# Altium schematic sheet Micro.SchDoc
size A; SheetNumber: 1; SheetTotal: 5; SPICEModelCacheCJDBQKXO: <root> / <DocumentId>CJDBQKXO</DocumentId> / <CacheFrame Number="0"> / <Model Name="cap" Kind="MDL"> / <Text>*Default semiconductor capacitor / .MODEL CAP C()</Text> / </Model> / </CacheFrame> / </root>
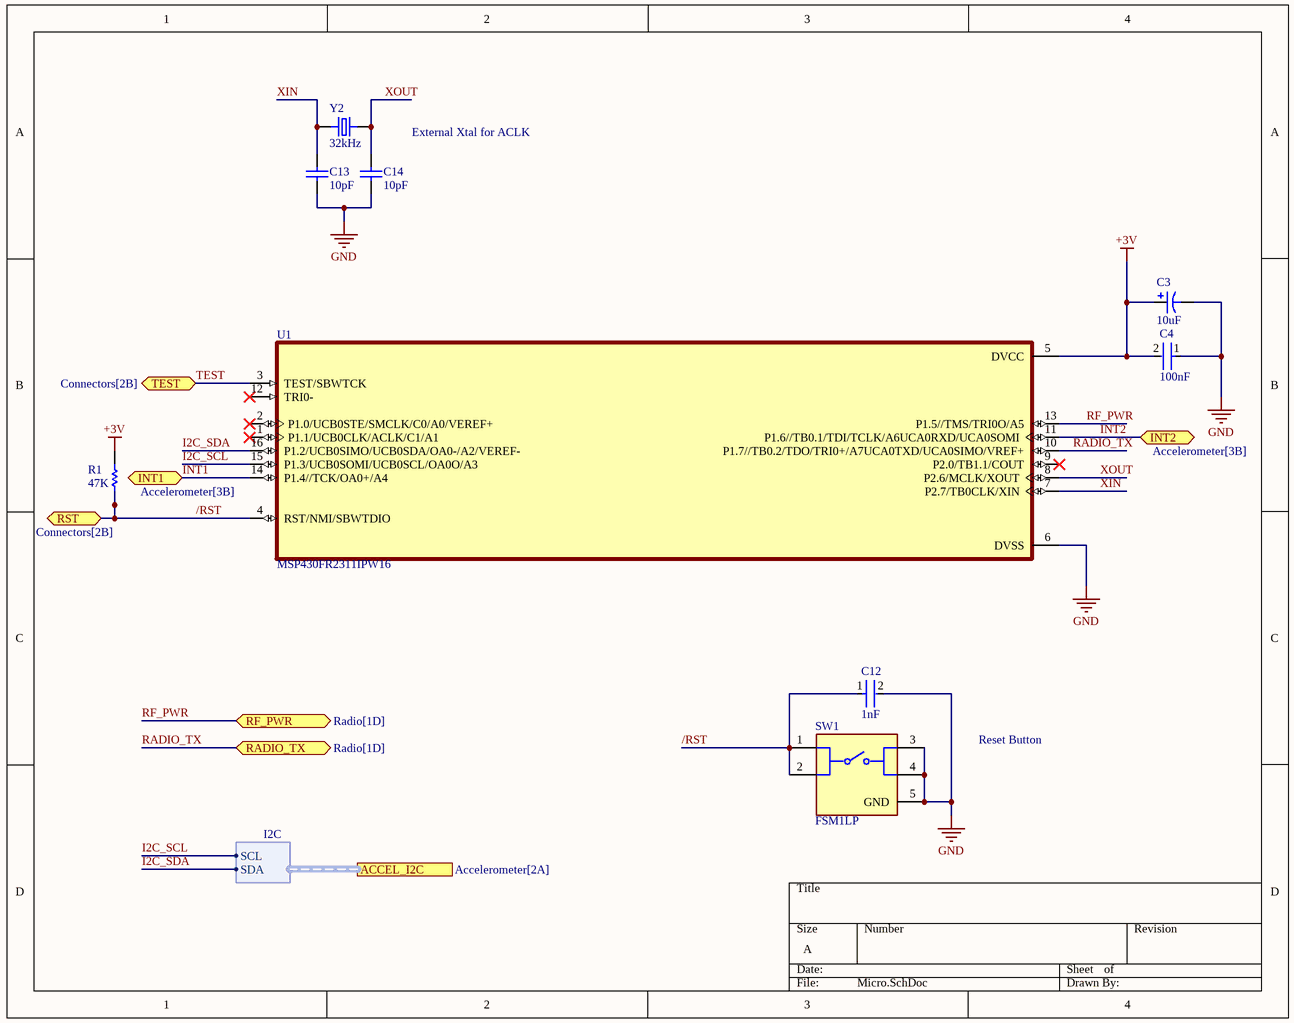
[diagram p0: Micro.SchDoc]

## Parts
C3  10uF  [C0805]
C4  100nF  [FP-C0402-BB-MFG]
C12  1nF  [FP-0603-L_1_6_0_15-W_0_81-IPC_A]
C13  10pF  [CAPC1608X90X40ML10T20]
C14  10pF  [CAPC1608X90X40ML10T20]
R1  47K  [J1-0603]
SW1  FSM1LP  [FP-FSM1LP-MFG]
U1  MSP430FR2311IPW16  [SOP65P640X120-16N]
Y2  32kHz  [XTAL_ECS-.327-6-34RR-TR]

## Ports
ACCEL_I2C (harness I2C, see Accelerometer[2A]), INT1 (bidir, see Accelerometer[3B]), INT2 (bidir, see Accelerometer[3B]), RADIO_TX (bidir, see Radio[1D]), RF_PWR (bidir, see Radio[1D]), RST (bidir, see Connectors[2B]), TEST (bidir, see Connectors[2B])

## Harnesses
I2C: SDA, SCL

## Nets
+3V: C3.1 C4.2 R1.2 U1.5(DVCC)
GND: C3.2 C4.1 C12.2 C13.1 C14.1 SW1.3 SW1.4 SW1.5(GND) U1.6(DVSS)
/RST: C12.1 R1.1 SW1.1 SW1.2 U1.4(RST/NMI/SBWTDIO) ; port RST
I2C_SCL: U1.15(P1.3/UCB0SOMI/UCB0SCL/OA0O/A3) ; port ACCEL_I2C.SCL
I2C_SDA: U1.16(P1.2/UCB0SIMO/UCB0SDA/OA0-/A2/VEREF-)
INT1: U1.14(P1.4//TCK/OA0+/A4) ; port INT1
INT2: U1.11(P1.6//TB0.1/TDI/TCLK/A6UCA0RXD/UCA0SOMI) ; port INT2
RADIO_TX: U1.10(P1.7//TB0.2/TDO/TRI0+/A7UCA0TXD/UCA0SIMO/VREF+) ; port RADIO_TX
RF_PWR: U1.13(P1.5//TMS/TRI0O/A5) ; port RF_PWR
TEST: U1.3(TEST/SBWTCK) ; port TEST
XIN: C13.2 U1.7(P2.7/TB0CLK/XIN) Y2.1(I/O)
XOUT: C14.2 U1.8(P2.6/MCLK/XOUT) Y2.2(O/I)

Not connected (* = marked no-connect by the designer): U1 1(P1.1/UCB0CLK/ACLK/C1/A1)* 2(P1.0/UCB0STE/SMCLK/C0/A0/VEREF+)* 9(P2.0/TB1.1/COUT)* 12(TRI0-)*

## Notes on the sheet
- External Xtal for ACLK
- Reset Button

## Library data of the parts
C3 = Cap Pol3: Alum. Electrolytic Cap 10µF 50V; 5mm Surface Mount; Lifetime 2000h; +105°C; Manufacturer: Wurth Electronics; Manufacturer Part Number: 865080642006; Polarity: Polar; Ripple Current: 95mA; Impedance: 2.8R; Life (Hours): 2000Hour; Tolerance: 20%; Published: 8-Jun-2000; LatestRevisionDate: 29-May-2009; LatestRevisionNote: IPC-7351 Footprint Added.; PackageReference: C0805; Publisher: Altium Limited; PackageDescription: Chip Capacitor; RoHS: Yes; Category: Aluminum Electrolytic Capacitors; Stock 1: 1; Pricing 1: 25=0.20400 (USD); Mount: Surface Mount; Case/Package: Radial; Min Operating Temperature: -55°C; Max Operating Temperature: 105°C; Package Quantity: 1; Packaging: Cut Tape; Voltage Rating: 50V; Ripple Current (AC): 95mA; Voltage Rating (DC): 50V; Capacitance: 10uF; Diameter: 5mm; Height: 5.5mm; Height - Seated (Max): 0.217inch; REACH SVHC: Unknown; RoHS Compliant: Yes; ComponentLink1URL: http://www.farnell.com/datasheets/1880176.pdf?src-supplier=Farnell; ComponentLink1Description: http://www.farnell.com/datasheets/1880176.pdf?src-supplier=Farnell; ComponentLink2URL: http://www.farnell.com/datasheets/1880176.pdf?src-supplier=Element14; ComponentLink2Description: http://www.farnell.com/datasheets/1880176.pdf?src-supplier=Element14; ComponentLink3URL: http://www.farnell.com/datasheets/1880176.pdf?src-supplier=Newark; ComponentLink3Description: http://www.farnell.com/datasheets/1880176.pdf?src-supplier=Newark; ComponentLink4URL: http://katalog.we-online.de/pbs/datasheet/865080642006.pdf?src-supplier=Digi-Key; ComponentLink4Description: http://katalog.we-online.de/pbs/datasheet/865080642006.pdf?src-supplier=Digi-Key; ComponentLink5URL: https://katalog.we-online.de/pbs/datasheet/865080642006.pdf?src-supplier=Digi-Key; ComponentLink5Description: https://katalog.we-online.de/pbs/datasheet/865080642006.pdf?src-supplier=Digi-Key; Supplier 1: RSComponents; Supplier Part Number 1: 8391862P
C4 = CMP-2008-02046-2: CAP CER 0.1UF 10V X5R 0402; Manufacturer: Kemet; Manufacturer Part Number: C0402C104K8PACTU; Material: Ceramic; Capacitance: 0.10 μF; Temperature Coefficient: 15%; Tolerance: 0.1; Value: 0.10 μF; Package: C0402-BB; Temperature: -55°C to +125°C; ComponentLink2Description: Datasheet; Temperature Characteristic: X5R; Device Class L1: Passive Components; Height: 0.55mm; Lead Free: Yes; ComponentLink2URL: https://content.kemet.com/datasheets/KEM_C1002_X7R_SMD.pdf; Device Class L2: Capacitors; Temperature Range Low: -55°C; Temperature Range High: +125°C; RoHS: TRUE; Octopart: https://octopart.com/c0402c104k8pactu-kemet-140039; Automotive: No; Mouser Description: Capacitor 100 nF 10 VDC 0402; Category: Cap; Voltage Rating: 10 V; Digikey Description: CAP CER 0.1UF 10V X5R 0402; Ipc Land Pattern Name: CAPC10050X50; Device Class L3: Ceramic Capacitors
C12 = CMP-2006-04378-2: General Purpose Ceramic Capacitor, 0603, 1nF, 10%, X7R, 15%, 50V; Case Code (Metric): 1608; Min Operating Temperature: -55°C; Weight: 7.1E-05oz; Series: -; Capacitance: 1nF; RoHS Compliant: Yes; Radiation Hardening: No; Height: 0.9mm; Mount: Surface Mount; REACH SVHC: No SVHC; Lead Free: Lead Free; Depth: 0.81mm; Voltage: 50V; Number of Pins: 2; Voltage Rating: 50V; Max Operating Temperature: 125°C; Termination: SMD/SMT; Construction: Flat; Case Code (Imperial): 0603; Dielectric: X7R; Width: 0.032inch; Tolerance: 10%; Case/Package: 0603; Contact Plating: Tin; Packaging: Tape and Reel; Voltage Rating (DC): 50V; Dielectric Material: Ceramic; Package Quantity: 4000; Thickness: 0.035inch; Length: 1.6mm; Supplier 1: Arrow Electronics; Supplier Part Number 1: 06035C102KAT2A
C13 C14 = CMP-2100-03593-1: Chip Capacitor, 10 pF, +/- 5%, 50 V, -55 to 125 degC, 0603 (1608 Metric), RoHS, Tape and Reel; Manufacturer: Yageo; Insulation Resistance: 100GR; Voltage Rating: 50V; Temperature Coefficient: 30ppm/degC; Dielectric: C0G; Radiation Hardening: No; Mount: SurfaceMount; Width: 0.031inch; Composition: Ceramic; Package Description: 2-Pin Surface Mount Device, Body 1.6 x 0.8 mm; Min Operating Temperature: -55degC; Case Code (Metric): 1608; Datasheet URL: http://www.yageo.com/documents/recent/UPY-GP_NP0_16V-to-50V_14.pdf; Termination: SMD/SMT; REACH SVHC: NoSVHC; Case/Package: 0603; RoHSCompliant: True; Packaging: TapeandReel; Max Operating Temperature: 125degC; Voltage: 50V; Package Quantity: 1; Manufacturer URL: http://www.yageo.com/; Tolerance: 5%; Capacitance: 10pF; Height: 0.8mm; Depth: 0.8mm; Thickness: 0.035inch; Case Code (Imperial): 0603; Length: 1.6mm; Package Reference: 0603; Voltage Rating (DC): 50V; Lead Free: LeadFree; Number of Pins: 2; Datasheet Version: Rev. 14, 07/2016; Supplier 1: Arrow Electronics; Supplier Part Number 1: CC0603JRNPO9BN100
R1 = Res1: Resistor; Published: 8-Jun-2000; LatestRevisionDate: 17-Jul-2002; LatestRevisionNote: Re-released for DXP Platform.; PackageReference: AXIAL-0.3; Publisher: Altium Limited; PackageDescription: Axial Device, Thru-Hole; 2 Leads; 0.3 in Pin Spacing; Value: 47K
SW1 = CMP-03402-000015-1: SWITCH TACTILE SPST-NO 0.05A 24V; Electrical Life: 100000Cycles; Actuator Type: Standard; Contact Resistance: 100mR; Current Rating: 50mA; Operating Force: 1.57N; Actuator Material: Polyphthalamide; Illumination Type: Non-Illuminated; Actuator Length: 0.01inch; Voltage Rating (DC): 12V; Throw Configuration: SPST; Switch Travel: 0.25mm; Switch Function: Off-Mom; Actuator Color: Black; Length: 6.19mm; Min Operating Temperature: -35°C; Contact Material: Copper Alloy; Max Current Rating: 50mA; Max Operating Temperature: 85°C; Packaging: Loose Piece; Lead Free: Lead Free; Mount: Surface Mount; RoHS Compliant: Yes; Orientation: Straight; Package Quantity: 2000; Mechanical Life: 100000Cycles; Type: Switch; ELV: Compliant; Depth: 8mm; Contact Plating: Silver; Max Voltage Rating (DC): 12V; REACH SVHC: No SVHC; Series: FSM1LP; Contact Current Rating: 50mA; Termination: Gull Wing; Supplier 1: Arrow Electronics; Supplier Part Number 1: FSM1LP
U1 = MSP430FR2311IPW16: 16MHz integrated analog microcontroller with 3.75KB FRAM, Op-Amp, TIA, Comparator w/ DAC, 10-bit ADC 16-TSSOP -40 to 85; MF: Texas Instruments; SnapEDA_Link: https://www.snapeda.com/parts/MSP430FR2311IPW16/Texas+Instruments/view-part/?ref=snap; Availability: In Stock; Package: TSSOP-16 Texas Instruments; Check_prices: https://www.snapeda.com/parts/MSP430FR2311IPW16/Texas+Instruments/view-part/?ref=eda; Price: None; MP: MSP430FR2311IPW16; Purchase-URL: https://pricing.snapeda.com/search/part/MSP430FR2311IPW16/?ref=eda; Value: *
Y2 = ECS-.327-6-34RR-TR: 32.768kHz Â±20ppm Crystal 6pF 40 kOhms 2-SMD, No Lead; MF: ECS Inc.; SnapEDA_Link: https://www.snapeda.com/parts/ECS-.327-6-34RR-TR/ECS%20Inc./view-part/2047718/?ref=snap; Value: *; MP: ECS-.327-6-34RR-TR; Package: SMD-2 TE Connectivity; DigiKey-Purchase-URL: https://snapeda.com/shop?store=DigiKey&id=2047718; Digi-Key_Part_Number: XC2296CT-ND; Supplier 1: Digi-Key; Supplier Part Number 1: XC2296CT-ND